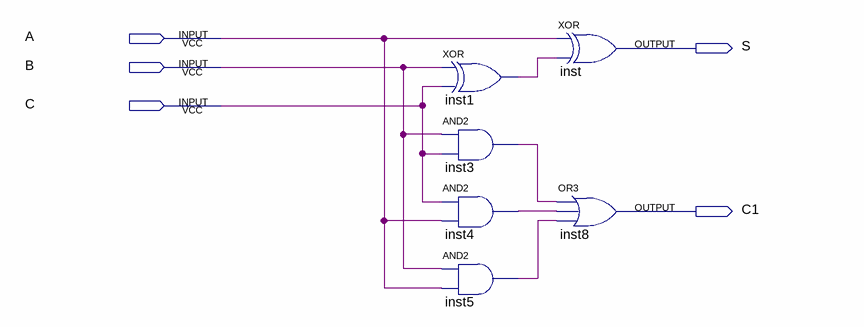
[diagram p0: schematic sheet]
// Quartus schematic sdProjectUnidadeSomador.bdf as structural Verilog: 6 symbols, 5 pins
module sdProjectUnidadeSomador (
  input  A,
  input  B,
  input  C,
  output S,
  output C1
);

  wire inst1_out, inst3_out, inst4_out, inst5_out;

  xor inst1 (inst1_out, B, C);
  and inst3 (inst3_out, B, C);
  and inst4 (inst4_out, C, A);
  and inst5 (inst5_out, B, A);
  xor inst (S, A, inst1_out);
  or inst8 (C1, inst3_out, inst4_out, inst5_out);
endmodule
